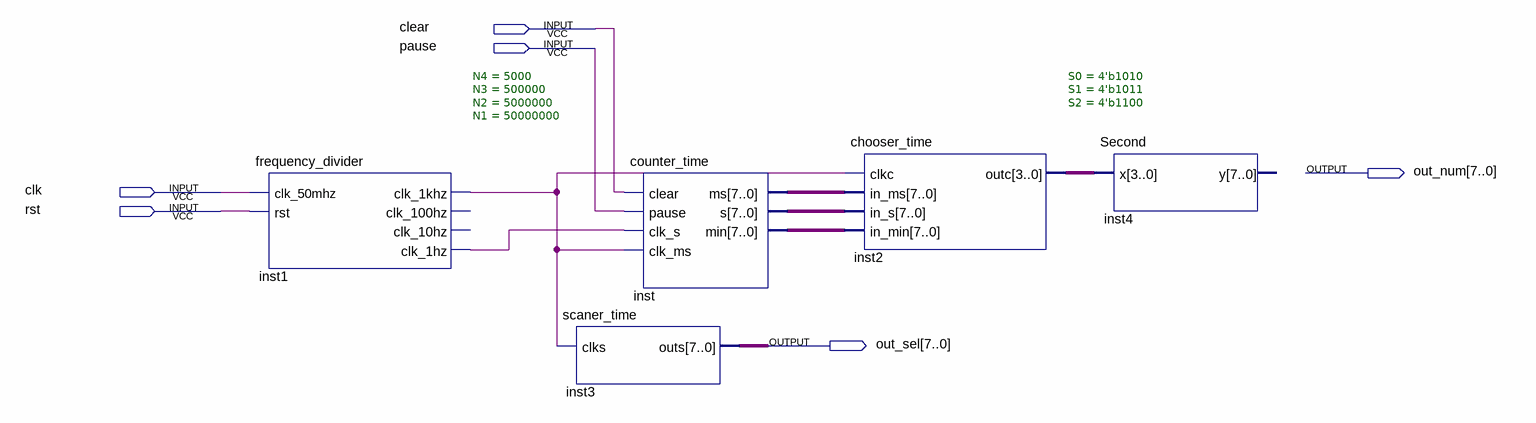
[diagram p0: schematic sheet]
// Quartus schematic testoften.bdf as structural Verilog: 5 symbols, 6 pins
module testoften (
  input  clear,
  input  pause,
  input  clk,
  input  rst,
  output [7:0] out_num,
  output [7:0] out_sel
);

  wire inst1_clk_1hz, inst1_clk_1khz;
  wire [3:0] inst2_outc;
  wire [7:0] inst_min, inst_ms, inst_s;

  frequency_divider #(.N4(5000), .N3(500000), .N2(5000000), .N1(50000000)) inst1 (
    .clk_50mhz(clk), .rst(rst), .clk_1khz(inst1_clk_1khz), .clk_1hz(inst1_clk_1hz));  // open: clk_100hz, clk_10hz
  counter_time inst (
    .clear(clear), .pause(pause), .clk_s(inst1_clk_1hz), .clk_ms(inst1_clk_1khz), .ms(inst_ms), .s(inst_s),
    .min(inst_min));
  scaner_time inst3 (.clks(inst1_clk_1khz), .outs(out_sel));
  chooser_time #(.S0(4'b1010), .S1(4'b1011), .S2(4'b1100)) inst2 (
    .clkc(inst1_clk_1khz), .in_ms(inst_ms), .in_s(inst_s), .in_min(inst_min), .outc(inst2_outc));
  Second inst4 (.x(inst2_outc));  // open: y
endmodule
